# Altium schematic sheet sche.SchDoc
size A
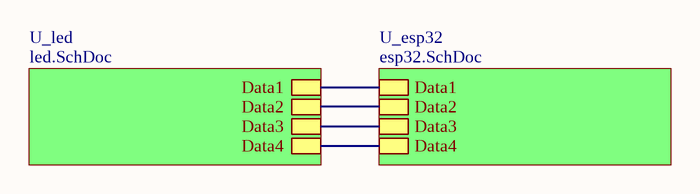
[diagram p0: sche.SchDoc]

## Sub-sheets
U_esp32 = esp32.SchDoc: Data1, Data2, Data3, Data4
U_led = led.SchDoc: Data1, Data2, Data3, Data4

## Nets
(unnamed): sheet U_esp32/Data1, sheet U_led/Data1
(unnamed): sheet U_esp32/Data2, sheet U_led/Data2
(unnamed): sheet U_esp32/Data3, sheet U_led/Data3
(unnamed): sheet U_esp32/Data4, sheet U_led/Data4